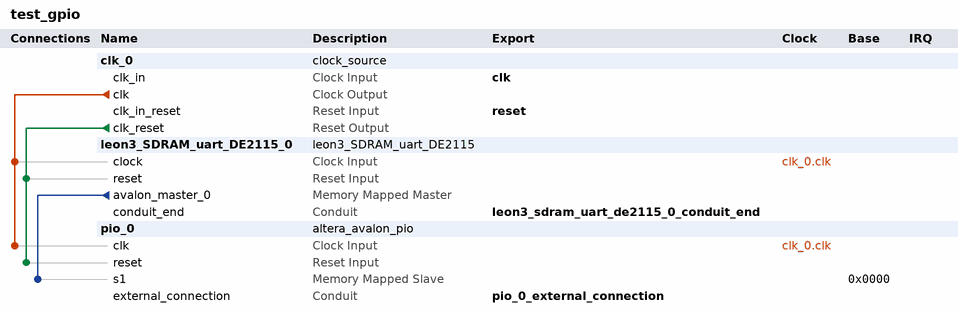
[diagram p0: system contents]
# Platform Designer (Qsys) system test_gpio, Cyclone IV E EP4CE115F29C7
# Parameters at their usual value, and those the tool derives, are not listed.
package require -exact qsys 13.1
create_system test_gpio
set_project_property DEVICE_FAMILY {Cyclone IV E}
set_project_property DEVICE EP4CE115F29C7

add_instance clk_0 clock_source 13.1
set_instance_parameter_value clk_0 clockFrequency 50000000

add_instance leon3_SDRAM_uart_DE2115_0 leon3_SDRAM_uart_DE2115 1.0
set_instance_parameter_value leon3_SDRAM_uart_DE2115_0 fabtech 27
set_instance_parameter_value leon3_SDRAM_uart_DE2115_0 memtech 27
set_instance_parameter_value leon3_SDRAM_uart_DE2115_0 padtech 27
set_instance_parameter_value leon3_SDRAM_uart_DE2115_0 clktech 27
set_instance_parameter_value leon3_SDRAM_uart_DE2115_0 disas 0
set_instance_parameter_value leon3_SDRAM_uart_DE2115_0 dbguart 0
set_instance_parameter_value leon3_SDRAM_uart_DE2115_0 pclow 2

add_instance pio_0 altera_avalon_pio 13.1
set_instance_parameter_value pio_0 direction Output
set_instance_parameter_value pio_0 width 8

# connections
add_connection clk_0.clk leon3_SDRAM_uart_DE2115_0.clock clock
add_connection clk_0.clk pio_0.clk clock
add_connection clk_0.clk_reset leon3_SDRAM_uart_DE2115_0.reset reset
add_connection clk_0.clk_reset pio_0.reset reset
add_connection leon3_SDRAM_uart_DE2115_0.avalon_master_0 pio_0.s1 avalon
set_connection_parameter_value leon3_SDRAM_uart_DE2115_0.avalon_master_0/pio_0.s1 baseAddress 0x0000

# exported interfaces
add_interface clk clock sink
set_interface_property clk EXPORT_OF clk_0.clk_in
add_interface reset reset sink
set_interface_property reset EXPORT_OF clk_0.clk_in_reset
add_interface leon3_sdram_uart_de2115_0_conduit_end conduit end
set_interface_property leon3_sdram_uart_de2115_0_conduit_end EXPORT_OF leon3_SDRAM_uart_DE2115_0.conduit_end
add_interface pio_0_external_connection conduit end
set_interface_property pio_0_external_connection EXPORT_OF pio_0.external_connection

set_interconnect_requirement {$system} qsys_mm.clockCrossingAdapter HANDSHAKE
set_interconnect_requirement {$system} qsys_mm.maxAdditionalLatency 1
set_interconnect_requirement {$system} qsys_mm.insertDefaultSlave false

save_system test_gpio.qsys
